# Altium schematic sheet JtagToUPDI.SchDoc
size A4; SheetNumber: 1; SheetTotal: 1
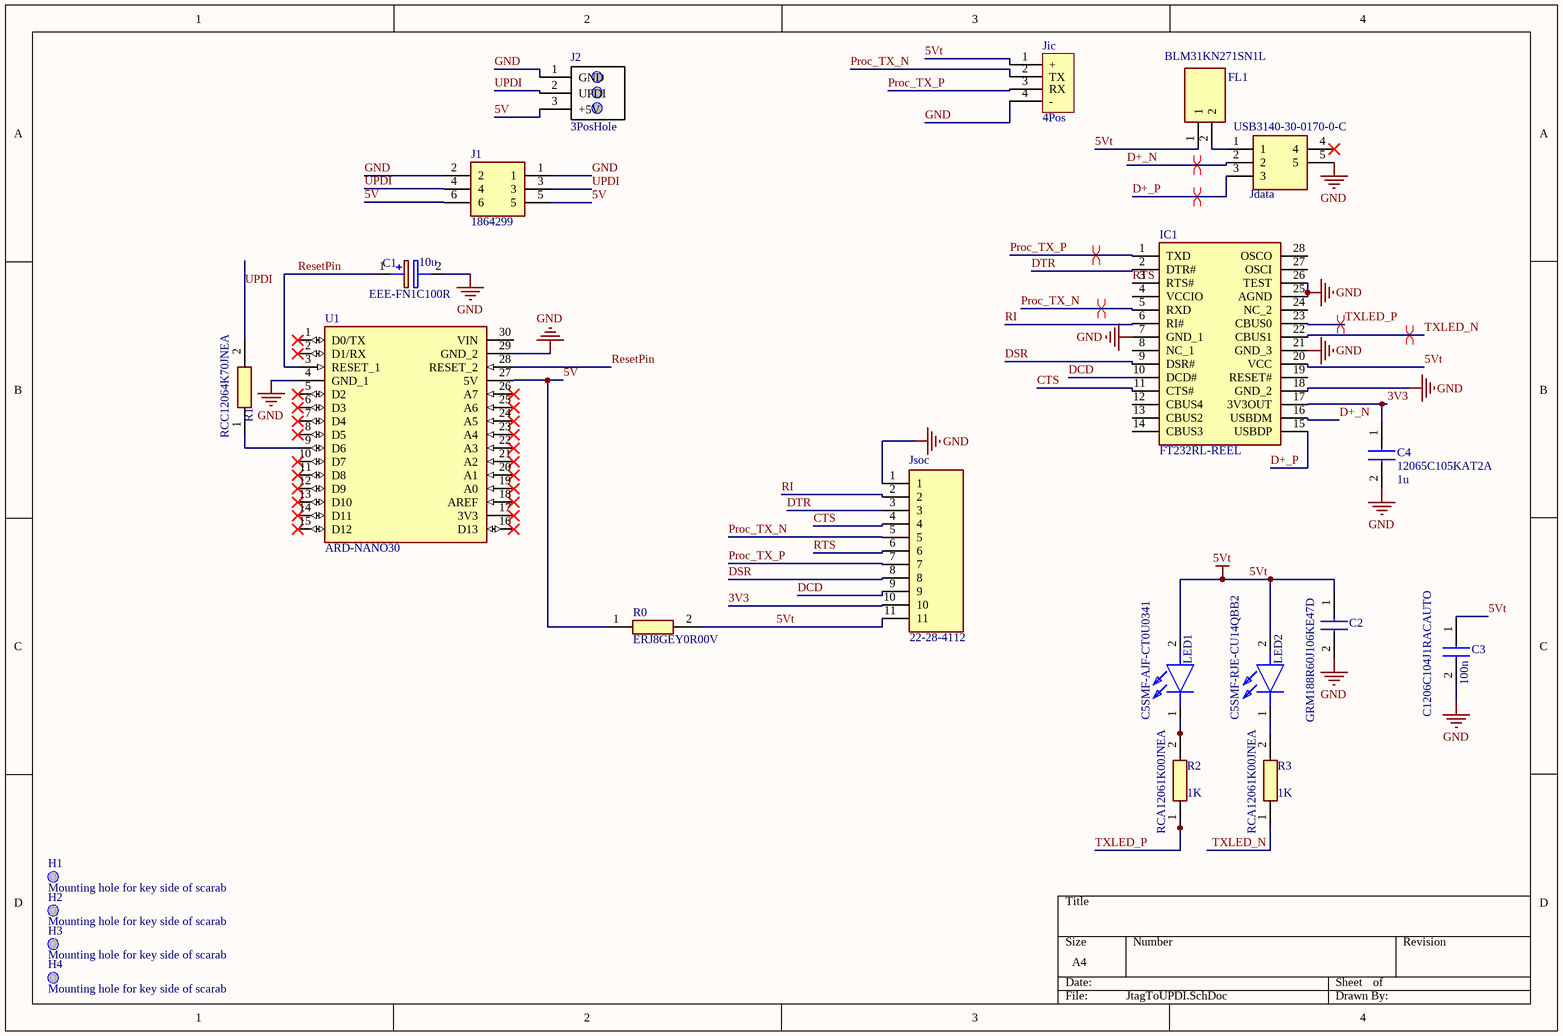
[diagram p0: JtagToUPDI.SchDoc]

## Parts
C1  EEE-FN1C100R  value 10u  [EEE1AA220WR]
C2  GRM188R60J106KE47D  [CAPC1608X90N]
C3  C1206C104J1RACAUTO  value 100n  [C1206]
C4  12065C105KAT2A  value 1u  [C1206]
FL1  BLM31KN271SN1L  [BLM31KN102BH1L]
H1  Mounting hole for key side of scarab  [MTHup]
H2  Mounting hole for key side of scarab  [MTHup]
H3  Mounting hole for key side of scarab  [MTHup]
H4  Mounting hole for key side of scarab  [MTHup]
IC1  FT232RL-REEL  [SOP65P778X200-28N]
J1  1864299  [1864299]
J2  3PosHole  [CON-PRG-3PIN]
Jdata  USB3140-30-0170-0-C  [USB31403001700C]
Jic  4Pos  [CON-PRG-4PIN]
Jsoc  22-28-4112  [HDRV11W66P0X254_1X11_2794X249X978P]
LED1  C5SMF-AJF-CT0U0341  [C5SMFRJECU14QBB2]
LED2  C5SMF-RJE-CU14QBB2  [C5SMFRJECU14QBB2]
R0  ERJ8GEY0R00V  [RESC3116X70N]
R1  RCC12064K70JNEA  [RESC3116X70N]
R2  RCA12061K00JNEA  value 1K  [RESC3116X65N]
R3  RCA12061K00JNEA  value 1K  [RESC3116X65N]
U1  ARD-NANO30  [MODULE_A000005]

## Nets
5Vt: C2.1 C3.1 FL1.1 IC1.20(VCC) Jic.1(+) Jsoc.11 LED1.2(A) LED2.2(A) R0.2
GND: C1.2(-) C2.2 C3.2 C4.2 IC1.7(GND_1) IC1.18(GND_2) IC1.21(GND_3) IC1.25(AGND) IC1.26(TEST) J1.1 J1.2 J2.1(GND) Jdata.5 Jic.4(-) Jsoc.1 U1.4(GND_1) U1.29(GND_2)
3V3: C4.1 IC1.17(3V3OUT) Jsoc.10
5V: J1.5 J1.6 J2.3(+5V) R0.1 U1.27(5V)
CTS: IC1.11(CTS#) Jsoc.4
D+_N: IC1.16(USBDM) Jdata.2
D+_P: IC1.15(USBDP) Jdata.3
DCD: IC1.10(DCD#) Jsoc.9
DSR: IC1.9(DSR#) Jsoc.8
DTR: IC1.2(DTR#) Jsoc.3
Proc_TX_N: IC1.5(RXD) Jic.2(TX) Jsoc.5
Proc_TX_P: IC1.1(TXD) Jic.3(RX) Jsoc.7
ResetPin: C1.1(+) U1.3(RESET_1) U1.28(RESET_2)
RI: IC1.6(RI#) Jsoc.2
RTS: IC1.3(RTS#) Jsoc.6
TXLED_N: IC1.22(CBUS1) R3.1
TXLED_P: IC1.23(CBUS0) R2.1
UPDI: J1.3 J1.4 J2.2(UPDI) R1.2
NetFL1_2: FL1.2 Jdata.1
NetLED1_1: LED1.1(K) R2.2
NetLED2_1: LED2.1(K) R3.2
NetR1_1: R1.1 U1.9(D6)

Not connected (* = marked no-connect by the designer): IC1 4(VCCIO) 8(NC_1) 12(CBUS4) 13(CBUS2) 14(CBUS3) 19(RESET#) 24(NC_2) 27(OSCI) 28(OSCO); Jdata 4*; U1 1(D0/TX)* 2(D1/RX)* 5(D2)* 6(D3)* 7(D4)* 8(D5)* 10(D7)* 11(D8)* 12(D9)* 13(D10)* 14(D11)* 15(D12)* 16(D13)* 17(3V3)* 18(AREF)* 19(A0)* 20(A1)* 21(A2)* 22(A3)* 23(A4)* 24(A5)* 25(A6)* 26(A7)* 30(VIN)

## Layout directives
differential pair: D+_N, D+_P, Proc_TX_N, Proc_TX_P, TXLED_N, TXLED_P

## Library data of the parts
C1 = EL-10uF: Aluminium Electrolytic Capacitors - SMD 16VDC 10uF 20% 90mA AEC-Q200; Manufacturer_Name: Panasonic; Datasheet Link: http://industrial.panasonic.com/cdbs/www-data/pdf/RDE0000/RDE0000C1259.pdf; Height: 5.5mm; Manufacturer_Part_Number: EEE-FN1C100R; Mouser Part Number: 667-EEE-FN1C100R; Mouser Price/Stock: https://www.mouser.co.uk/ProductDetail/Panasonic/EEE-FN1C100R?qs=OlC7AqGiEDkM1emDreS51w%3D%3D; Arrow Part Number: EEE-FN1C100R; Arrow Price/Stock: https://www.arrow.com/en/products/eee-fn1c100r/panasonic; Supplier 1: Mouser; Supplier Part Number 1: 667-EEE-FN1C100R
C2 = GRM188R60J106KE47D: Capacitor; Manufacturer_Name: Murata Electronics; Datasheet Link: https://search.murata.co.jp/Ceramy/image/img/A01X/G101/ENG/GRM188R60J106KE47-02.pdf; Height: 0.9mm; Manufacturer_Part_Number: GRM188R60J106KE47D; Mouser Part Number: 81-GRM188R60J106KE7D; Mouser Price/Stock: https://www.mouser.co.uk/ProductDetail/Murata-Electronics/GRM188R60J106KE47D?qs=OezBPCAUt14%252Bu%252BtP1j3sig%3D%3D; Arrow Part Number: GRM188R60J106KE47D; Arrow Price/Stock: https://www.arrow.com/en/products/grm188r60j106ke47d/murata-manufacturing?region=nac; Supplier 1: Mouser; Supplier Part Number 1: 81-GRM188R60J106KE7D
C3 = 100nF: Multilayer Ceramic Capacitors MLCC - SMD/SMT 100V 0.1uF X7R 1206 5% AEC-Q200; Manufacturer_Name: KEMET; Datasheet Link: https://content.kemet.com/datasheets/KEM_C1023_X7R_AUTO_SMD.pdf; Manufacturer_Part_Number: C1206C104J1RACAUTO; Mouser Part Number: 80-C1206C104J1RAUTO; Mouser Price/Stock: https://www.mouser.co.uk/ProductDetail/KEMET/C1206C104J1RACAUTO?qs=ds50AKTGxA9j0bB4hqTS6Q%3D%3D; Supplier 1: Mouser; Supplier Part Number 1: 80-C1206C104J1RAUTO
C4 = 1uF1206: Multilayer Ceramic Capacitors MLCC - SMD/SMT NEW GLOBAL PN KGM31HR71H105KU 50V 1uF X7R 1206 10%; Manufacturer_Name: KEMET; Manufacturer_Part_Number: C1206C104J1RACAUTO; Datasheet Link: https://content.kemet.com/datasheets/KEM_C1023_X7R_AUTO_SMD.pdf; Mouser Part Number: 80-C1206C104J1RAUTO; Mouser Price/Stock: https://www.mouser.co.uk/ProductDetail/KEMET/C1206C104J1RACAUTO?qs=ds50AKTGxA9j0bB4hqTS6Q%3D%3D; Supplier 1: Mouser; Supplier Part Number 1: 581-12065C105KAT2A
FL1 = FB_270OHM_4A5: Ferrite Beads 270 OHM 4.5A Alternate Sizing Guide Below; Manufacturer_Name: Murata Electronics; Datasheet Link: https://www.murata.com/en-us/products/productdetail?partno=BLM31KN271SN1%23; Height: 1.8mm; Manufacturer_Part_Number: BLM31KN271SN1L; Mouser Part Number: 81-BLM31KN271SN1L; Mouser Price/Stock: https://www.mouser.co.uk/ProductDetail/Murata-Electronics/BLM31KN271SN1L?qs=EU6FO9ffTwcEvcRcNMANJA%3D%3D; Arrow Part Number: BLM31KN271SN1L; Arrow Price/Stock: https://www.arrow.com/en/products/blm31kn271sn1l/murata-manufacturing?region=nac; Supplier 1: Mouser; Supplier Part Number 1: 81-BLM31KN271SN1L
H1-H4 = MountHole_SCARABup: Supplier 1: Mouser
  H1 H2: Supplier Part Number 1: 855-R25-3002002
  H3 H4: Supplier Part Number 1: 144-04M025045HN
IC1 = FT232RL: USB Interface IC USB to Serial UART Enhanced IC SSOP-28; Manufacturer_Name: FTDI Chip; Datasheet Link: http://www.ftdichip.com/Support/Documents/DataSheets/ICs/DS_FT232R.pdf; Height: 2mm; Manufacturer_Part_Number: FT232RL-REEL; Mouser Part Number: 895-FT232RL; Mouser Price/Stock: https://www.mouser.co.uk/ProductDetail/FTDI/FT232RL-REEL?qs=D1%2FPMqvA103RC6OU6bKtoA%3D%3D; Arrow Part Number: FT232RL-REEL; Arrow Price/Stock: https://www.arrow.com/en/products/ft232rl-reel/ftdi-chip?region=nac; Supplier 1: Mouser; Supplier Part Number 1: 895-FT232RL
J1 = 1864299: Connector; Manufacturer_Name: Phoenix Contact; Datasheet Link: https://datasheet.datasheetarchive.com/originals/distributors/DKDS-31/613776.pdf; Height: 10.9mm; Manufacturer_Part_Number: 1864299; Mouser Part Number: 651-1864299; Mouser Price/Stock: https://www.mouser.co.uk/ProductDetail/Phoenix-Contact/1864299?qs=K5ytOU5dogrwHSrEygz0tw%3D%3D; Arrow Part Number: 1864299; Arrow Price/Stock: https://www.arrow.com/en/products/1864299/phoenix-contact?region=nac; Supplier 1: Mouser; Supplier Part Number 1: 651-1864299
Jdata = USB_B_Micro: USB Connectors Micro B Skt, Vertical, SMT, 30u", W/1.7mm stake, no MEF, T&R+cap; Manufacturer_Name: GCT (GLOBAL CONNECTOR TECHNOLOGY); Datasheet Link: https://gct.co/files/drawings/usb3140.pdf; Height: 6.7mm; Manufacturer_Part_Number: USB3140-30-0170-0-C; Mouser Part Number: 640-USB31403001700C; Mouser Price/Stock: https://www.mouser.co.uk/ProductDetail/GCT/USB3140-30-0170-0-C?qs=KUoIvG%2F9IlYQ5y%252BQm2TPIg%3D%3D; Supplier 1: Future Electronics; Supplier Part Number 1: 7088906
Jsoc = 22-28-4112: Connector; Manufacturer_Name: Molex; Datasheet Link: https://gr.mouser.com/datasheet/2/276/3/0022284112_PCB_HEADERS-2870009.pdf; Height: 9.78mm; Manufacturer_Part_Number: 22-28-4112; Mouser Part Number: 538-22-28-4112; Mouser Price/Stock: https://www.mouser.co.uk/ProductDetail/Molex/22-28-4112?qs=GAPJcf4kvdtiO4x%252B%2FrzvFw%3D%3D
LED1 = LED_Y: Standard LEDs - Through Hole Amber Oval; Manufacturer_Name: CREE LED; Manufacturer_Part_Number: C5SMF-RJE-CU14QBB2; Datasheet Link: http://www.cree.com/led-components/media/documents/C5SMF-RJF-RJE-GJF-GJE-BJF-BJE-1240.pdf; Height: 8.5mm; Mouser Part Number: 941-C5SMFRJECU14QBB2; Mouser Price/Stock: https://www.mouser.co.uk/ProductDetail/Cree-Inc/C5SMF-RJE-CU14QBB2?qs=1sbE9T7hb3YsVvX6UAERxA%3D%3D; Supplier 1: Mouser; Supplier Part Number 1: 941-C5SMFAJFCT0U0341
LED2 = LED_R: LED; Manufacturer_Name: CREE LED; Datasheet Link: http://www.cree.com/led-components/media/documents/C5SMF-RJF-RJE-GJF-GJE-BJF-BJE-1240.pdf; Height: 8.5mm; Manufacturer_Part_Number: C5SMF-RJE-CU14QBB2; Mouser Part Number: 941-C5SMFRJECU14QBB2; Mouser Price/Stock: https://www.mouser.co.uk/ProductDetail/Cree-Inc/C5SMF-RJE-CU14QBB2?qs=1sbE9T7hb3YsVvX6UAERxA%3D%3D; Supplier 1: Mouser; Supplier Part Number 1: 941-C5SMFRJECU14QBB2
R0 = 0Ohm1206: Thick Film Resistors - SMD 1206 Zero ohm Jumper 0.05 AEC-Q200; Manufacturer_Name: Panasonic; Datasheet Link: https://datasheet.datasheetarchive.com/originals/distributors/SFDatasheet-1/sf-00039130.pdf; Height: 0.7mm; Manufacturer_Part_Number: ERJ8GEY0R00V; Supplier 1: Mouser; Supplier Part Number 1: 667-ERJ-8GEY0R00V
R1 = R4K7: Thick Film Resistors - SMD 4.7Kohms 1% 100ppm; Manufacturer_Name: Panasonic; Manufacturer_Part_Number: ERJ8GEY0R00V; Datasheet Link: https://datasheet.datasheetarchive.com/originals/distributors/SFDatasheet-1/sf-00039130.pdf; Height: 0.7mm; Supplier 1: Mouser; Supplier Part Number 1: 71-RCC12064K70JNEA
R2 R3 = 1K: Thick Film Resistors - SMD RCA1206 1K0 5% 200 ET1 e3; Manufacturer_Name: Panasonic; Manufacturer_Part_Number: ERJ8GEY0R00V; Datasheet Link: https://datasheet.datasheetarchive.com/originals/distributors/SFDatasheet-1/sf-00039130.pdf; Height: 0.7mm; Supplier 1: Mouser; Supplier Part Number 1: 71-RCA12061K00JNEA
U1 = A000005: Small, complete, and breadboard-friendly board based on the ATmega328 (Arduino Nano 3.x).; Check_prices: https://www.snapeda.com/parts/A000005/Arduino/view-part/?ref=eda; Value: *; Availability: In Stock; MP: A000005; Price: None; Package: Non-Standard Arduino; SnapEDA_Link: https://www.snapeda.com/parts/A000005/Arduino/view-part/?ref=snap; Purchase-URL: https://pricing.snapeda.com/search/part/A000005/?ref=eda; MF: Arduino; Supplier 1: Mouser; Supplier Part Number 1: 992-ARD-NANO30